# Altium schematic sheet CAN.SchDoc
size 420 x 297 mm; SheetNumber: 8; SheetTotal: 11
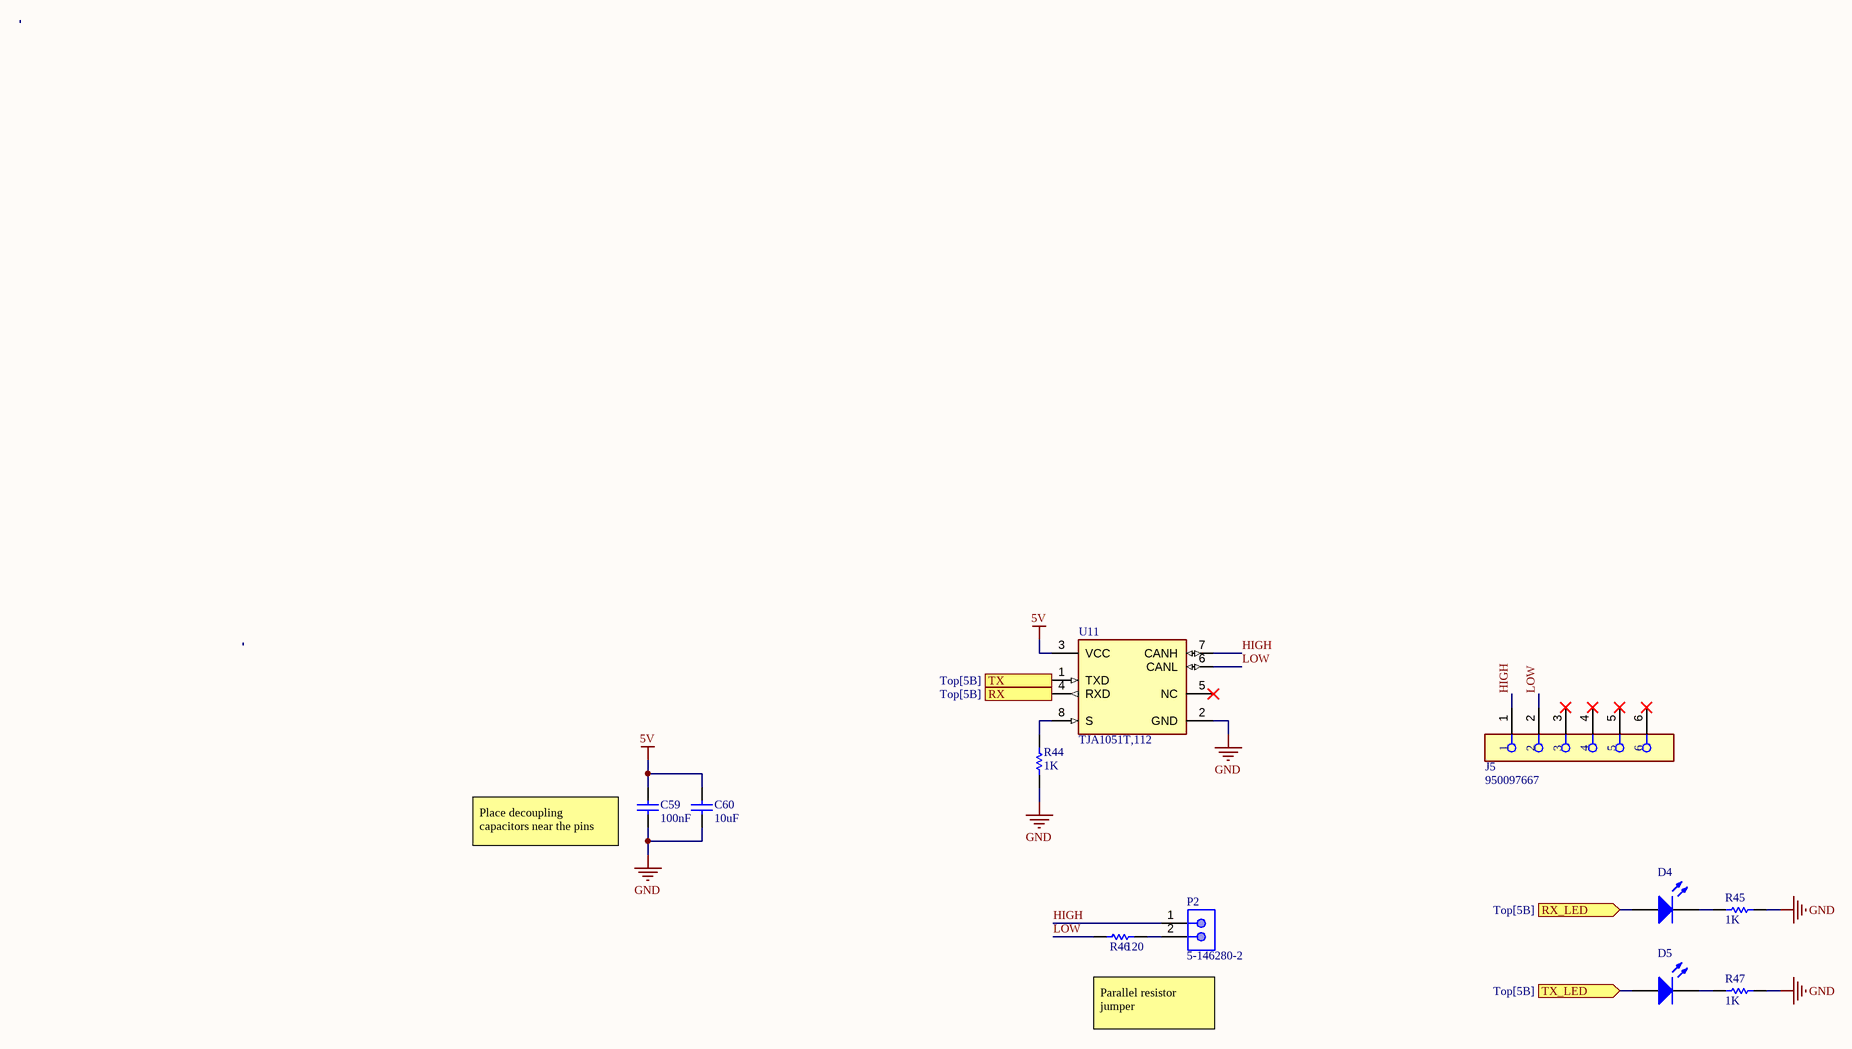
[diagram p0: CAN.SchDoc]

## Parts
C59  value 100nF  (hidden comment: Capacitor)
C60  value 10uF  (hidden comment: Capacitor)
D4  Light-Emitting Diode  (value not drawn)
D5  Light-Emitting Diode  (value not drawn)
J5  950097667  [FP-950097667-MFG]
P2  5-146280-2  [TECO-5-146280-2_V]
R44  value 1K  (hidden comment: Resistor)
R45  value 1K  (hidden comment: Resistor)
R46  value 120  (hidden comment: Resistor)
R47  value 1K  (hidden comment: Resistor)
U11  TJA1051T,112  [FP-SOT96-1-MFG]

## Ports
RX (out, see Top[5B]), RX_LED (in, see Top[5B]), TX (in, see Top[5B]), TX_LED (in, see Top[5B])

## Nets
5V: C59.2 C60.2 U11.3(VCC)
GND: C59.1 C60.1 R44.1 R45.2 R47.2 U11.2(GND)
HIGH: J5.1 P2.1 U11.7(CANH)
LOW: J5.2 R46.1 U11.6(CANL)
RX: U11.4(RXD) ; port RX
RX_LED: D4.1(A) ; port RX_LED
TX: U11.1(TXD) ; port TX
TX_LED: D5.1(A) ; port TX_LED
NetD4_2: D4.2(K) R45.1
NetD5_2: D5.2(K) R47.1
NetP2_2: P2.2 R46.2
NetR44_2: R44.2 U11.8(S)

Not connected (* = marked no-connect by the designer): J5 3* 4* 5* 6*; U11 5(NC)*

## Notes on the sheet
- (near C59) Place decoupling capacitors near the pins
- Parallel resistor jumper
- THIS DOCUMENT AND THE DATA DISCLOSED HEREIN OR
- HEREWITH IS THE PROPERTY OF ALTIUM LIMITED AND MAY
- DWG NO:
- REVISION
- REV:
- DESCRIPTION
- DATE
- APPROVED
- BE FREELY DISTRIBUTED IN WHOLE. NO RIGHTS ARE
- RESERVED OR EXPRESS OR IMPLIED WARANTEE GIVEN.
- ENG:
- APPROVALS
- PROJECT
- DSN:
- CHK:
- REFERENCE DOCUMENTS
- PROJECT REVISION:
- TITLE
- DOCUMENT REVISION:
- DESIGN ITEM:
- BOM:
- FAB DWG:
- PCB DWG:
- ASSY DWG:
- SCALE:
- A3
- SIZE
- CAGE CODE
- FILE NAME
- DWG NO.
- SHEET
- OF
- REV

## Library data of the parts
C59 C60 = Capacitor: SimulationGenericComponent: True; Supplier 1: Arrow Electronics
D4 D5 = LED: AF: 1; BV: 0; BV_MAX: 1e99; EG: 1.11; FC: 0.5; IBV: 0.001; IS: 1e-14; MJSW: 0.33; NTUN: 30; TNOM: 27; XTI: 3; SimulationGenericComponent: True; CJO: 0; CJP: 0; CTA: 0; CTP: 0; FCS: 0.5; FV_MAX: 1e99; IKF: 0; IKR: 0; ISR: 1e-14; JSW: 0; JTUN: 0; JTUNSW: 0; KEG: 1; KF: 0; LEVEL: 1; N: 1; NBV: 1; NR: 1; NS: 1; PHP: 1; RS: 0; TCV: 0; TLEV: 0; TLEVC: 0; TM1: 0; TM2: 0; TPB: 0; TPHP: 0; TRS: 0; TRS2: 0; TT: 0; TTT1: 0; TTT2: 0; VJ: 1; XTITUN: 3
J5 = CMP-04778-000001-1: CONN MOD JACK 6P6C R/A UNSHLD; Manufacturer: Molex; Conn Gender: Female; Number Of Contacts: 6; Voltage Rating: 125V; Conn Orientation: Right Angle; Current Rating: 1.5A; Is Female: yes; Pitch: 1.27mm; Temperature Range Low: -40°C; Device Class L2: Modular / Ethernet Connectors; ComponentLink2URL: https://www.molex.com/webdocs/datasheets/pdf/en-us/0950097667_MODULAR_JACKS_PLUG.pdf; Temperature Range High: +80°C; Contact Material: Gold,Nickel; Automotive: No; Digikey Description: CONN MOD JACK 6P6C R/A UNSHLD; Octopart: https://octopart.com/95009-7667-molex-24622630; Device Class L1: Connectors; RoHS: TRUE; Category: Conn; Package: 950097667; Manufacturer Part Number: 950097667; ComponentLink2Description: Datasheet; Device Class L3: unset; Mouser Description: Modular Connectors / Ethernet Connectors STD JACK RA 6/6 NO RIB; Height: 16.25mm; Footprint Url: https://www.molex.com/pdm_docs/sd/950097667_sd.pdf; Temperature: -40°C to +80°C; Lead Free: Yes
P2 = CMP-2000-07492-1: Male Header, Pitch 2.54 mm, 1 x 2 Position, Height 8.21 mm, Tail Length 3.05 mm, -65 to 105 degC, RoHS, Bulk; Manufacturer: TE Connectivity; Mating Connector Lock: No(Without); Number of Positions: 2; Pitch: 2.54mm; PCB Mounting Orientation: Vertical; Keyed: No; Case\/Package: 100; Mating Post Length: 0.23inch; High Temperature Housing: Yes; Max Current Rating: 5A; PCB Thickness: 0.063inch; PCB Mount Retention: Without; Approvals: CSA; Current Rating: 3A; Radiation Hardening: No; Length: 4.67mm; Contact Mating Length: 0.23inch; Connector Type: Header; Number of Rows: 1; Termination Post Length: 0.12inch; Board Standoff: No(Without); Max Operating Temperature: 105degC; Contact Shape: Square; Selectively Loaded: No(Without); Gasket: No(Without); Number of Contacts: 2; Contact Gender: Male; Mating Alignment: No(Without); Manufacturer URL: http://www.te.com/; Datasheet URL: http://www.te.com/commerce/DocumentDelivery/DDEController?Action=showdoc&DocId=Customer+Drawing%7F146280%7FH1%7Fpdf%7FEnglish%7FENG_CD_146280_H1.pdf%7F5-146280-2; Mount: ThroughHole; Orientation: Straight; Packaging: Carton; Package Reference: 5-146280-2; Package Quantity: 500; Stabilizers: No(Without); Row Spacing: 2.54mm; Contact Material: CopperAlloy; Panel Mount Retention: No(Without); Datasheet Version: Rev. H1, 08/2016; Housing Colour: Black; Colour: Black; Package Description: Male Header, Pitch 2.54 mm, 1 x 2 Position, Height 8.21 mm, Tail Length 3.05 mm; Contact Plating: Matte; Housing Material: Polymer; Contact Protection: No(Without); Min Operating Temperature: -65degC; Mounting Technology: ThroughHole; Flammability Rating: UL94V-0; RoHSCompliant: true; Termination: ThroughHole; Depth: 2.34mm; High Speed Serial Data Connector: No
R44-R47 = Resistor: TC1: 0; SimulationGenericComponent: True; TC2: 0
U11 = CMP-10098-000004-1: IC TRANSCEIVER HALF 1/1 8SO; Manufacturer: NXP Semiconductors; Max Supply Voltage: 5.5V; Interface: CAN; Automotive Grade: Grade 0; Nominal Supply Current: 1-80mA; Max Junction Temp: +150°C; Standoff Height: 0.1mm; Min Supply Voltage: 4.5V; Lead Free: Yes; ComponentLink2URL: https://www.nxp.com/docs/en/data-sheet/TJA1051.pdf; Temperature Range High: +150°C; RoHS: TRUE; Package: SOT96-1; Digikey Description: IC TRANSCEIVER HALF 1/1 8SO; Device Class L3: unset; Device Class L2: Interface ICs; Manufacturer Part Number: TJA1051T,112; Device Class L1: Integrated Circuits (ICs); Automotive: Yes; Temperature: -40°C to +150°C; Octopart: https://octopart.com/tja1051t%2C112-nxp+semiconductors-11542082; Category: IC; Mouser Description: TJA1051 Series 5.5 V 1 Mbit/s Surface Mount High-Speed CAN Transceiver - SOIC-8; ComponentLink2Description: Datasheet; Footprint Url: https://www.nxp.com/docs/en/package-information/SOT96-1.pdf; Height: 1.75mm; Temperature Range Low: -40°C